# EasyEDA Pro project 无线充电接收端.epro, schematic 无线充电接收V2.1
Board Name: 无线充电接收V2.1; Create Date: 2025-07-14; Page Name: P1; Project Name: （5月更新）无线充电接收端; Schematic Name: 无线充电接收V2.1; Update Date: 2025-07-14; Company: 嘉立创EDA; Page Size: A4; Version: V1.0
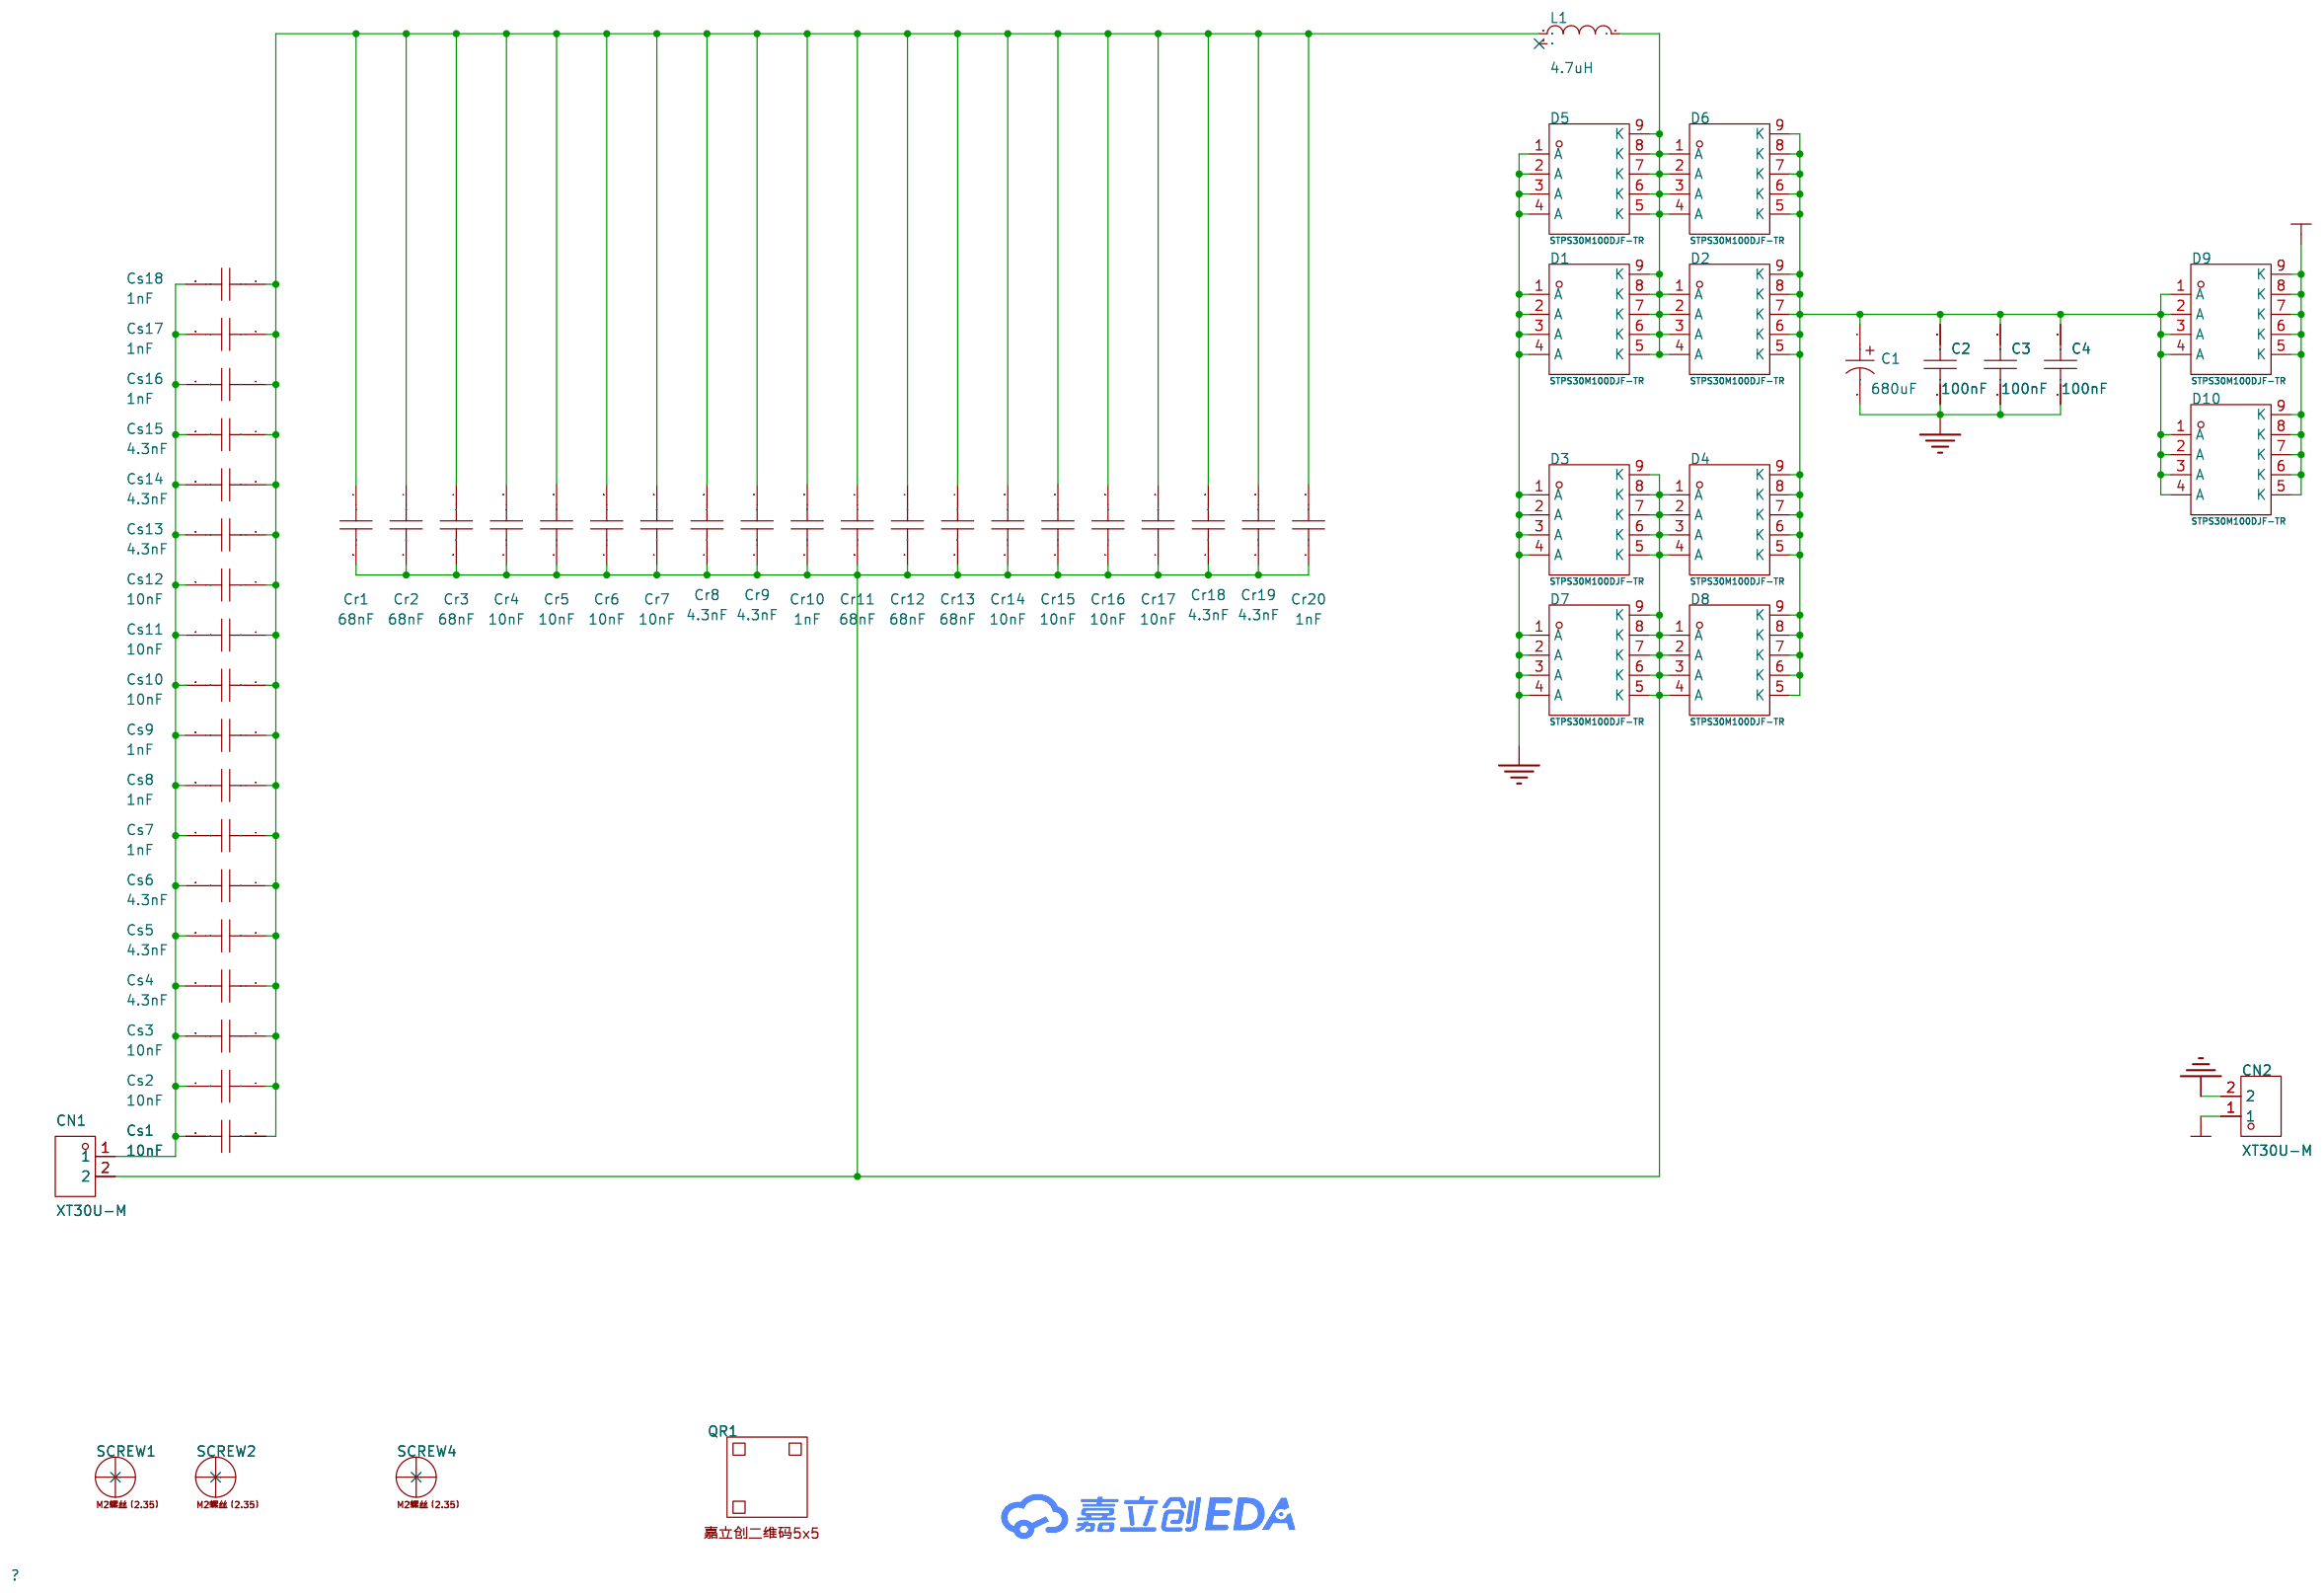
[diagram p3: schematic sheet]

## Parts
C1  680uF  [CAP-TH_BD8.0-P3.50-D0.6-FD]
C2  100nF  [C1206]
C3  100nF  [C1206]
C4  100nF  [C1206]
CN1  XT30U-M  [CONN-TH_XT30U-M]
CN2  XT30U-M  [CONN-TH_XT30U-M]
Cr1  68nF  [C1206]
Cr2  68nF  [C1206]
Cr3  68nF  [C1206]
Cr4  10nF  [C1206]
Cr5  10nF  [C1206]
Cr6  10nF  [C1206]
Cr7  10nF  [C1206]
Cr8  4.3nF  [C1206]
Cr9  4.3nF  [C1206]
Cr10  1nF  [C1206]
Cr11  68nF  [C1206]
Cr12  68nF  [C1206]
Cr13  68nF  [C1206]
Cr14  10nF  [C1206]
Cr15  10nF  [C1206]
Cr16  10nF  [C1206]
Cr17  10nF  [C1206]
Cr18  4.3nF  [C1206]
Cr19  4.3nF  [C1206]
Cr20  1nF  [C1206]
Cs1  10nF  [C1206]
Cs2  10nF  [C1206]
Cs3  10nF  [C1206]
Cs4  4.3nF  [C1206]
Cs5  4.3nF  [C1206]
Cs6  4.3nF  [C1206]
Cs7  1nF  [C1206]
Cs8  1nF  [C1206]
Cs9  1nF  [C1206]
Cs10  10nF  [C1206]
Cs11  10nF  [C1206]
Cs12  10nF  [C1206]
Cs13  4.3nF  [C1206]
Cs14  4.3nF  [C1206]
Cs15  4.3nF  [C1206]
Cs16  1nF  [C1206]
Cs17  1nF  [C1206]
Cs18  1nF  [C1206]
D1  STPS30M100DJF-TR  [PDFN-8_L5.8-W4.9-P1.27-LS6.1-BL]
D2  STPS30M100DJF-TR  [PDFN-8_L5.8-W4.9-P1.27-LS6.1-BL]
D3  STPS30M100DJF-TR  [PDFN-8_L5.8-W4.9-P1.27-LS6.1-BL]
D4  STPS30M100DJF-TR  [PDFN-8_L5.8-W4.9-P1.27-LS6.1-BL]
D5  STPS30M100DJF-TR  [PDFN-8_L5.8-W4.9-P1.27-LS6.1-BL]
D6  STPS30M100DJF-TR  [PDFN-8_L5.8-W4.9-P1.27-LS6.1-BL]
D7  STPS30M100DJF-TR  [PDFN-8_L5.8-W4.9-P1.27-LS6.1-BL]
D8  STPS30M100DJF-TR  [PDFN-8_L5.8-W4.9-P1.27-LS6.1-BL]
D9  STPS30M100DJF-TR  [PDFN-8_L5.8-W4.9-P1.27-LS6.1-BL]
D10  STPS30M100DJF-TR  [PDFN-8_L5.8-W4.9-P1.27-LS6.1-BL]
L1  4.7uH  [IND-SMD_3P-L28.0-W19.0-LS27.0]
QR1  -  [JLC-QRCODE-5x5]
SCREW1  -  [M2螺丝（2.35）]
SCREW2  -  [M2螺丝（2.35）]
SCREW4  -  [M2螺丝（2.35）]

## Library data of the parts
C1 = 217EC0019: 容值:680uF;精度:±20%;额定电压:35V;纹波电流:3.65A@100kHz;等效串联电阻(ESR):28mΩ@100kHz;; LCSC Part Name: 680uF ±20% 35V; Supplier Part: C42371890; Manufacturer: KNSCHA(科尼盛); Supplier Footprint: 插件,D8xL16mm; Datasheet: https://atta.szlcsc.com/upload/public/pdf/source/20241106/965C52BEE72BE8020D9BF3C0AA67995E.pdf; Supplier: LCSC; Tolerance: ±20%; Voltage Rated: 35V; Ripple Current: 3.65A@100kHz; Equivalent Series Resistance(ESR): 28mΩ@100kHz; Lead Spacing: 3.5mm; Diameter: 8mm; Height - Seated (Max): 16mm; Lifetime @ Temp: 2000hrs@105℃; Operating Temperature: -55℃~+105℃
C2-C4 = GRM31C5C2A104JA01L: 容值:100nF;精度:±5%;额定电压:100V;材质(温度系数):C0G;; LCSC Part Name: 100nF ±5% 100V; Supplier Part: C405303; Manufacturer: muRata(村田); Supplier Footprint: 1206; Datasheet: https://atta.szlcsc.com/upload/public/pdf/source/20190717/C405303_DB26B790B590E67035A9C43E8E89903F.pdf; Supplier: LCSC; Tolerance: ±5%; Voltage Rated: 100V; Temperature Coefficient: C0G
CN1 CN2 = XT30U-M: 类别:-;类型1:-;; LCSC Part Name: AMASS(艾迈斯)轻量版锂电池插头公头 XT30U-M; Supplier Part: C99101; Manufacturer: AMASS(艾迈斯); JLCPCB Part Class: Extended Part; Datasheet: https://atta.szlcsc.com/upload/public/pdf/source/20170606/1496716542582.pdf; Supplier: LCSC; Brand: 艾迈斯; Type: 插头; Colour: 黄色; InterfaceType: 公头
Cr1-Cr3 Cr11-Cr13 = C3216C0G2A683JT000E: 容值:68nF;精度:±5%;额定电压:100V;温度系数:C0G;; LCSC Part Name: 68nF ±5% 100V; Supplier Part: C2991821; Manufacturer: TDK; Supplier Footprint: 1206; Datasheet: https://atta.szlcsc.com/upload/public/pdf/source/20220415/21C3EB6AB80DD056499B4D8EFDFCCE0A.pdf; Supplier: LCSC; Tolerance: ±5%; Voltage Rating: 100V; Temperature Coefficient: C0G
Cr4-Cr7 Cr14-Cr17 Cs1-Cs3 Cs10-Cs12 = GCM3195C2A103JA16D: 容值:10nF;精度:±5%;额定电压:100V;材质(温度系数):C0G;; LCSC Part Name: 10nF ±5% 100V; Supplier Part: C184799; Manufacturer: muRata(村田); Supplier Footprint: 1206; Datasheet: https://atta.szlcsc.com/upload/public/pdf/source/20191226/C475964_3FAF76C90CD8FFB09F50C7480ADA926F.pdf; Supplier: LCSC; Tolerance: ±5%; Voltage Rated: 100V; Temperature Coefficient: C0G
Cr8 Cr9 Cr18 Cr19 Cs4-Cs6 Cs13-Cs15 = GRM3195C2A432JA01D: 容值:4.3nF;精度:±5%;额定电压:100V;材质(温度系数):C0G;; LCSC Part Name: 4.3nF ±5% 100V; Supplier Part: C2178478; Manufacturer: muRata(村田); Supplier Footprint: 1206; Datasheet: https://atta.szlcsc.com/upload/public/pdf/source/20230811/FF87FF72FFBF946A2511FFE3CC64A1B1.pdf; Supplier: LCSC; Tolerance: ±5%; Voltage Rated: 100V; Temperature Coefficient: C0G
Cr10 Cr20 Cs7-Cs9 Cs16-Cs18 = CC1206JKNPOCBN102: 容值:1nF;精度:±5%;额定电压:1kV;材质(温度系数):NP0;; LCSC Part Name: 1nF ±5% 1kV; Supplier Part: C113872; Manufacturer: YAGEO(国巨); Supplier Footprint: 1206; Datasheet: https://atta.szlcsc.com/upload/public/pdf/source/20170914/C128857_1505359892143968080.pdf; Supplier: LCSC; Tolerance: ±5%; Voltage Rated: 1kV; Temperature Coefficient: NP0
D1-D10 = STPS30M100DJF-TR: 二极管配置:独立式;正向压降(Vf):960mV@30A;直流反向耐压(Vr):100V;整流电流:30A;; LCSC Part Name: 电压:100V 电流:30A; Supplier Part: C2688545; Manufacturer: ST(意法半导体); Supplier Footprint: Power-FLAT(5x6); Datasheet: https://atta.szlcsc.com/upload/public/pdf/source/20210617/C2688545_980EF861F75FD1B8BE8FC1FD966E2E4C.pdf; Supplier: LCSC; Diode Configuration: 独立式; Forward Voltage (Vf@If): 960mV@30A; Reverse Voltage (Vr): 100V; Rectified Current: 30A; Reverse Leakage Current (Ir): 100uA@100V
L1 = RSBPQ2918-4R7M: 电感值:4.7uH;精度:±20%;额定电流:47.5A;饱和电流(Isat):49.5A;类型:扁平线大电流电感;; LCSC Part Name: 扁线大电流电感; Supplier Part: C32712987; Manufacturer: Ruishen(瑞申电子); Supplier Footprint: SMD-3P,28x20.3mm; Datasheet: https://atta.szlcsc.com/upload/public/pdf/source/20240725/68006C9F1CA03DEDE5951C9F792F9D9D.pdf; Supplier: LCSC; Tolerance: ±20%; Rated Current: 47.5A; Current - Saturation (Isat): 49.5A; DC Resistance (DCR): 0.97mΩ; Type: 扁平线大电流电感
QR1 = 嘉立创二维码5x5: Check: false
SCREW1 SCREW2 SCREW4 = M2螺丝（2.35）

## Nets
GND: C1.2 C2.1 C3.1 C4.1 CN2.2 D1.1(A) D1.2(A) D1.3(A) D1.4(A) D3.1(A) D3.2(A) D3.3(A) D3.4(A) D5.1(A) D5.2(A) D5.3(A) D5.4(A) D7.1(A) D7.2(A) D7.3(A) D7.4(A)
VCAP: CN2.1 D9.5(K) D9.6(K) D9.7(K) D9.8(K) D9.9(K) D10.5(K) D10.6(K) D10.7(K) D10.8(K) D10.9(K)
$1N505: CN1.2 Cr1.2 Cr2.2 Cr3.2 Cr4.1 Cr5.1 Cr6.1 Cr7.1 Cr8.1 Cr9.1 Cr10.1 Cr11.2 Cr12.2 Cr13.2 Cr14.1 Cr15.1 Cr16.1 Cr17.1 Cr18.1 Cr19.1 Cr20.1 D3.5(K) D3.6(K) D3.7(K) D3.8(K) D3.9(K) D4.1(A) D4.2(A) D4.3(A) D4.4(A) D7.5(K) D7.6(K) D7.7(K) D7.8(K) D7.9(K) D8.1(A) D8.2(A) D8.3(A) D8.4(A)
$1N630: D1.5(K) D1.6(K) D1.7(K) D1.8(K) D1.9(K) D2.1(A) D2.2(A) D2.3(A) D2.4(A) D5.5(K) D5.6(K) D5.7(K) D5.8(K) D5.9(K) D6.1(A) D6.2(A) D6.3(A) D6.4(A) L1.1
$1N944: C1.1 C2.2 C3.2 C4.2 D2.5(K) D2.6(K) D2.7(K) D2.8(K) D2.9(K) D4.5(K) D4.6(K) D4.7(K) D4.8(K) D4.9(K) D6.5(K) D6.6(K) D6.7(K) D6.8(K) D6.9(K) D8.5(K) D8.6(K) D8.7(K) D8.8(K) D8.9(K) D9.1(A) D9.2(A) D9.3(A) D9.4(A) D10.1(A) D10.2(A) D10.3(A) D10.4(A)
$1N10317: Cr1.1 Cr2.1 Cr3.1 Cr4.2 Cr5.2 Cr6.2 Cr7.2 Cr8.2 Cr9.2 Cr10.2 Cr11.1 Cr12.1 Cr13.1 Cr14.2 Cr15.2 Cr16.2 Cr17.2 Cr18.2 Cr19.2 Cr20.2 Cs1.1 Cs2.1 Cs3.1 Cs4.1 Cs5.1 Cs6.1 Cs7.1 Cs8.1 Cs9.1 Cs10.1 Cs11.1 Cs12.1 Cs13.1 Cs14.1 Cs15.1 Cs16.1 Cs17.1 Cs18.1 L1.2
$1N10703: CN1.1 Cs1.2 Cs2.2 Cs3.2 Cs4.2 Cs5.2 Cs6.2 Cs7.2 Cs8.2 Cs9.2 Cs10.2 Cs11.2 Cs12.2 Cs13.2 Cs14.2 Cs15.2 Cs16.2 Cs17.2 Cs18.2

Not connected (* = marked no-connect by the designer): L1 3*; SCREW1 1*; SCREW2 1*; SCREW4 1*
